# Altium schematic sheet 02_COM.SchDoc
size A4; SheetNumber: 3; SheetTotal: 5
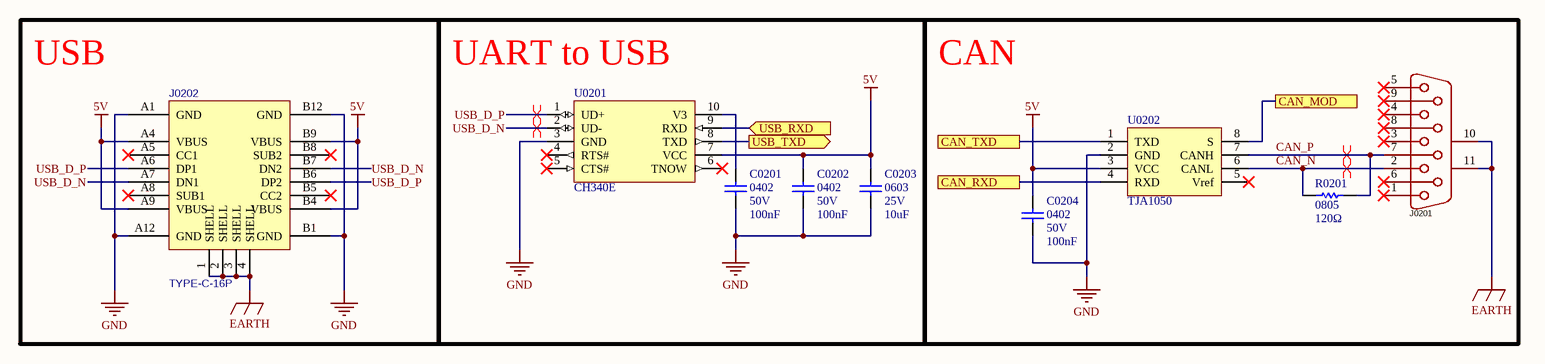
[diagram p0: 02_COM.SchDoc]

## Parts
C0201  Size: 0402  Volt: 50V  Cap: 100nF  [C0402]  (hidden comment: Cap)
C0202  Size: 0402  Volt: 50V  Cap: 100nF  [C0402]  (hidden comment: Cap)
C0203  Size: 0603  Volt: 25V  Cap: 10uF  [C0603]  (hidden comment: Cap)
C0204  Size: 0402  Volt: 50V  Cap: 100nF  [C0402]  (hidden comment: Cap)
J0201  DB9P  [DB9P]  (value not drawn)
J0202  TYPE-C-16P  [USB-C_16P]
R0201  Size: 0805  Res: 120Ω  [R0805]  (hidden comment: RES)
U0201  CH340E  [MSOP10]
U0202  TJA1050  [SOIC8_L W=3.9mm]

## Blocks framed on the sheet
USB: J0202
UART to USB: C0201 C0202 C0203 U0201
CAN: C0204 J0201 R0201 U0202

## Ports
CAN_MOD (see 00_McuComBrd[2A]), CAN_RXD (see 00_McuComBrd[2A]), CAN_TXD (see 00_McuComBrd[2A]), USB_RXD (in, see 00_McuComBrd[2B]), USB_TXD (out, see 00_McuComBrd[2B])

## Nets
5V: C0202.2 C0203.2 C0204.2 J0202.A4(VBUS) J0202.A9(VBUS) J0202.B4(VBUS) J0202.B9(VBUS) U0201.7(VCC) U0202.3(VCC)
EARTH: J0201.10(MH1) J0201.11(MH2) J0202.1(SHELL) J0202.2(SHELL) J0202.3(SHELL) J0202.4(SHELL)
GND: C0201.1 C0202.1 C0203.1 C0204.1 J0202.A1(GND) J0202.A12(GND) J0202.B1(GND) J0202.B12(GND) U0201.3(GND) U0202.2(GND)
CAN_MOD: U0202.8(S) ; port CAN_MOD
CAN_N: J0201.2 R0201.2 U0202.6(CANL)
CAN_P: J0201.7 R0201.1 U0202.7(CANH)
CAN_RXD: U0202.4(RXD) ; port CAN_RXD
CAN_TXD: U0202.1(TXD) ; port CAN_TXD
USB_D_N: J0202.A7(DN1) J0202.B7(DN2) U0201.2(UD-)
USB_D_P: J0202.A6(DP1) J0202.B6(DP2) U0201.1(UD+)
USB_RXD: U0201.9(RXD) ; port USB_RXD
USB_TXD: U0201.8(TXD) ; port USB_TXD
NetC0201_2: C0201.2 U0201.10(V3)

Not connected (* = marked no-connect by the designer): J0201 1* 3* 4* 5* 6* 8* 9*; J0202 A5(CC1)* A8(SUB1)* B5(CC2)* B8(SUB2)*; U0201 4(RTS#)* 5(CTS#)* 6(TNOW)*; U0202 5(Vref)*

## Layout directives
differential pair: CAN_N, CAN_P, USB_D_N, USB_D_P

## Library data of the parts
J0201 = DB9P: Manufacturer: Amphenol; Symbol: ID09S33E4GV00LF; Add into BOM: yes; Connector Type: D-Sub; Current Rating (Max): 5A; Device: ID09S33E4GV00LF; LCSC Part Name: D-Sub P数:9P; Supplier Part: C185657; Manufacturer Part: ID09S33E4GV00LF; Supplier Footprint: 弯插; JLCPCB Part Class: Extended Part; Datasheet: https://atta.szlcsc.com/upload/public/pdf/source/20180524/C185657_A3EAFC28C6ED417B8B89632C5DE17622.pdf; Supplier: LCSC; Convert to PCB: yes; Gender: -; Number of Pins: 9P; Mounting Style: 弯插; Number of Rows: 2; Contact Plating: 金; Operating Temperature Range: -55℃~+125℃
J0202 = USB-C-16P: BOM_Manufacturer: Shenzhen Kinghelm Elec; BOM_Manufacturer Part: KH-TYPE-C-16P; Contributor: LCSC; BOM_Supplier: LCSC; BOM_Supplier Part: C709357; BOM_JLCPCB Part Class: Extended Part; spicePre: U; spiceSymbolName: KH-TYPE-C-16P
R0201 = RES: 电阻; Current: 1A
U0201 = CH340E: USB to TTL Serial / UART